# Altium schematic sheet Camera_sdcard.SchDoc: Cameras and SD Card
size A4; Organization: Use Organization_Name in ProjParam; Address1: Eliot Ferragni; Address2: STI-MOBOTS; Address3: EPFL; Address4: CH-1015 LAUSANNE; DocumentNumber: 10; Revision: A; SheetNumber: 10; SheetTotal: 11; ApprovedBy: Init ApprovedBy in DocParam; CheckedBy: Init CheckedBy in DocParam; Author: Init Author in DocParam; CompanyName: Init CompanyName in DocParam; DrawnBy: Init DrawBy in DocParam; Engineer: Init Engineer in DocParam; Title2: 2 camera's connectors + micro sd card reader; DocumentName: Init DocumentName in DocParam; ProjectName: Init ProjectName in DocParam
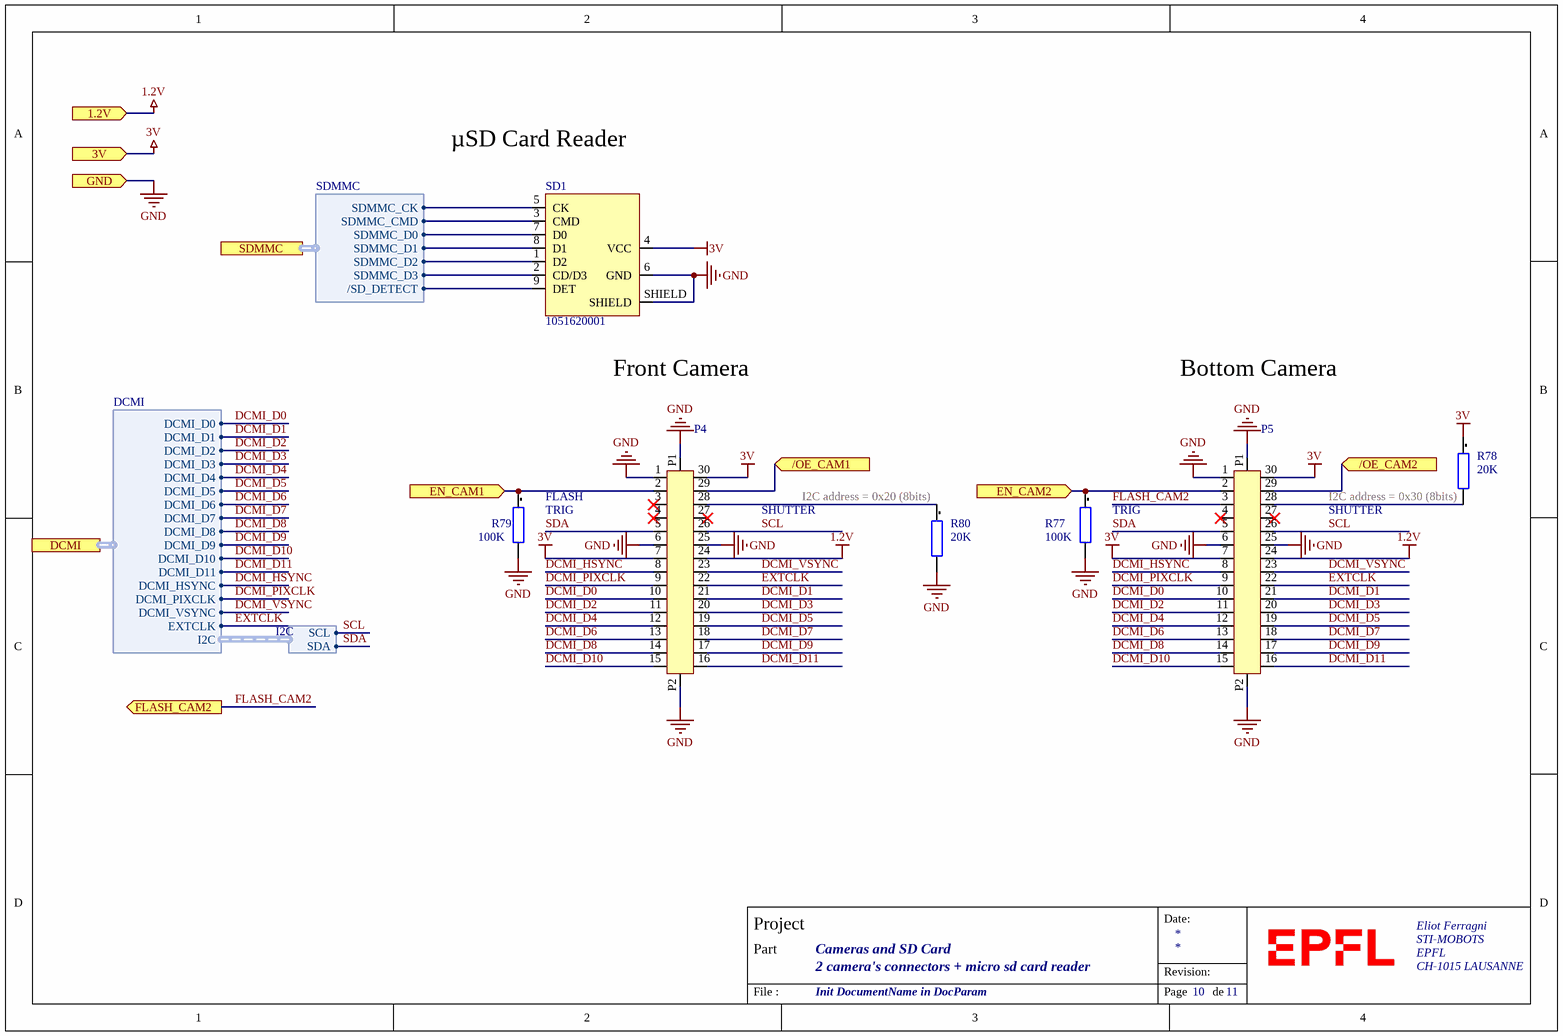
[diagram p0: Camera_sdcard.SchDoc]

## Parts
P4  HIROSE_BM23FR0.6-30DS-0.35V  [HIROSE_BM23FR0.6-30DS-0.35V]  (value not drawn)
P5  HIROSE_BM23FR0.6-30DS-0.35V  [HIROSE_BM23FR0.6-30DS-0.35V]  (value not drawn)
R77  100K  [RESC0201(0603)_L]
R78  20K  [RESC0201(0603)_L]
R79  100K  [RESC0201(0603)_L]
R80  20K  [RESC0201(0603)_L]
SD1  1051620001  [1051620001-with_card]

## Ports
1.2V (in), 3V (in), /OE_CAM1 (in), /OE_CAM2 (in), DCMI (harness DCMI), EN_CAM1 (in), EN_CAM2 (in), FLASH_CAM2 (out), GND (in), SDMMC (harness SDMMC)

## Harnesses
SDMMC: SDMMC_CK, SDMMC_CMD, SDMMC_D0, SDMMC_D1, SDMMC_D2, SDMMC_D3, /SD_DETECT
I2C: SDA, SCL
DCMI: DCMI_D0, DCMI_D1, DCMI_D2, DCMI_D3, DCMI_D4, DCMI_D5, DCMI_D6, DCMI_D7, DCMI_D8, DCMI_D9, DCMI_D10, DCMI_D11, DCMI_HSYNC, DCMI_PIXCLK, DCMI_VSYNC, I2C, EXTCLK

## Nets
1.2V: P4.24 P5.24 ; port 1.2V
3V: P4.7 P4.30 P5.7 P5.30 R78.1 SD1.4(VCC) ; port 3V
GND: P4.1 P4.6 P4.25 P4.P1 P4.P2 P5.1 P5.6 P5.25 P5.P1 P5.P2 R77.2 R79.2 R80.2 SD1.6(GND) SD1.SHIELD ; port GND
/OE_CAM1: P4.29 ; port /OE_CAM1
/OE_CAM2: P5.29 ; port /OE_CAM2
DCMI_D0: P4.10 P5.10 ; port DCMI.DCMI_D0
DCMI_D1: P4.21 P5.21 ; port DCMI.DCMI_D1
DCMI_D2: P4.11 P5.11 ; port DCMI.DCMI_D2
DCMI_D3: P4.20 P5.20 ; port DCMI.DCMI_D3
DCMI_D4: P4.12 P5.12 ; port DCMI.DCMI_D4
DCMI_D5: P4.19 P5.19 ; port DCMI.DCMI_D5
DCMI_D6: P4.13 P5.13 ; port DCMI.DCMI_D6
DCMI_D7: P4.18 P5.18 ; port DCMI.DCMI_D7
DCMI_D8: P4.14 P5.14 ; port DCMI.DCMI_D8
DCMI_D9: P4.17 P5.17 ; port DCMI.DCMI_D9
DCMI_D10: P4.15 P5.15 ; port DCMI.DCMI_D10
DCMI_D11: P4.16 P5.16 ; port DCMI.DCMI_D11
DCMI_HSYNC: P4.8 P5.8 ; port DCMI.DCMI_HSYNC
DCMI_PIXCLK: P4.9 P5.9 ; port DCMI.DCMI_PIXCLK
DCMI_VSYNC: P4.23 P5.23 ; port DCMI.DCMI_VSYNC
EN_CAM1: P4.2 R79.1 ; port EN_CAM1
EN_CAM2: P5.2 R77.1 ; port EN_CAM2
EXTCLK: P4.22 P5.22 ; port DCMI.EXTCLK
FLASH_CAM2: P5.3 ; port FLASH_CAM2
SCL: P4.26 P5.26 ; harness I2C.SCL
SDA: P4.5 P5.5 ; harness I2C.SDA
NetP4_28: P4.28 R80.1
NetP5_28: P5.28 R78.2
NetSD1_1: SD1.1(D2) ; port SDMMC.SDMMC_D2
NetSD1_2: SD1.2(CD/D3) ; port SDMMC.SDMMC_D3
NetSD1_3: SD1.3(CMD) ; port SDMMC.SDMMC_CMD
NetSD1_5: SD1.5(CK) ; port SDMMC.SDMMC_CK
NetSD1_7: SD1.7(D0) ; port SDMMC.SDMMC_D0
NetSD1_8: SD1.8(D1) ; port SDMMC.SDMMC_D1
NetSD1_9: SD1.9(DET) ; port SDMMC./SD_DETECT

Not connected (* = marked no-connect by the designer): P4 3* 4* 27*; P5 4* 27*

## Notes on the sheet
- µSD Card Reader
- Front Camera
- Bottom Camera
- (near R79) TRIG
- (near R79) FLASH
- SHUTTER
- (near R80) I2C address = 0x20 (8bits)
- (near R77) TRIG
- (near R78) I2C address = 0x30 (8bits)
- Date:
- Project
- Part
- Revision:
- File :
- Page
- de

## Library data of the parts
P4 P5 = HIROSE_BM23FR0.6-30DS-0.35V[[/\]]1: 2 x 15 Hirose header BM23FR0.6 Serie, 0.35 pitch, SMD, Mate at 0.6mm with receptacle, 0.3A signal contacts; Manufacturer part number: BM23FR0.6-30DS-0.35V(895); Preference: 1; Currentie: CHF; Note: To buy by assembler; Footprint Acort: ToDefine; ComponentLink1Description: Supplier link; ComponentLink1URL: https://www.hirose.com/product/series/BM23FR?lang=en; Supplier: Mouser; Supplier Nr: 798-3FR0630DS035V895; Manufacturer: Hirose; Manufacturer Nr: BM23FR0.6-30DS-0.35V; ROHS: True; Type: SMD; Orientation: Vertical; DateLastUpdate: 2019-09-20 / 1:27:08 PM; Quant_1: 1; Price_1: 1,19; Package / Case: Connector
R77-R80 = TBD[[/\]]0201[[/\]]1: Resistor 0201; Preference: 1; Currentie: CHF; Note: To buy by assembler; Size: 0201; Footprint Acort: 0201; ROHS: True; DateLastUpdate: 2018-10-19 / 9:06:49 AM; Type: SMD; Manufacturer: -; Manufacturer part number: -; Package / Case: Resistor 0201
SD1 = 1051620001: Conn Micro SD Card HDR 8 POS 1.09mm Solder RA SMD Embossed T/R 0.5A; Manufacturer: Molex; Connector Type: Connector; Max Voltage Rating (DC): 5V; Number of Contacts: 8; Note: To buy by assembler; Supplier 1: Digi-Key; Stock 1: 20361; Pricing 1: 1 = 0,92000, 10 = 0,81300, 100 = 0,70110, 500 = 0,57360, 1000 = 0,50987 (USD); RoHS: Yes; Mount: Surface Mount; Contact Material: Bronze; Contact Plating: Gold; Housing Material: Thermoplastic; Min Operating Temperature: -40°C; Max Operating Temperature: 85°C; Packaging: Tape and Reel; Number of Rows: 1; Package Quantity: 6000; Termination: Solder; Orientation: Right Angle; Number of Circuits: 8; Length: 11.3mm; Depth: 7.6mm; Pitch: 1.09mm; Radiation Hardening: No; ComponentLink1URL: https://datasheet.ciiva.com/29723/1051620101-sd-29723393.pdf?src-supplier=Digi-Key; ComponentLink1Description: https://datasheet.ciiva.com/29723/1051620101-sd-29723393.pdf?src-supplier=Digi-Key; Supplier Part Number 1: WM14405CT-ND; Manufacturer Part Number: 1051620001; Type: SMD; Package / Case: Micro SD receptacle